# EAGLE schematic main_board (EAGLE 9.6.2)
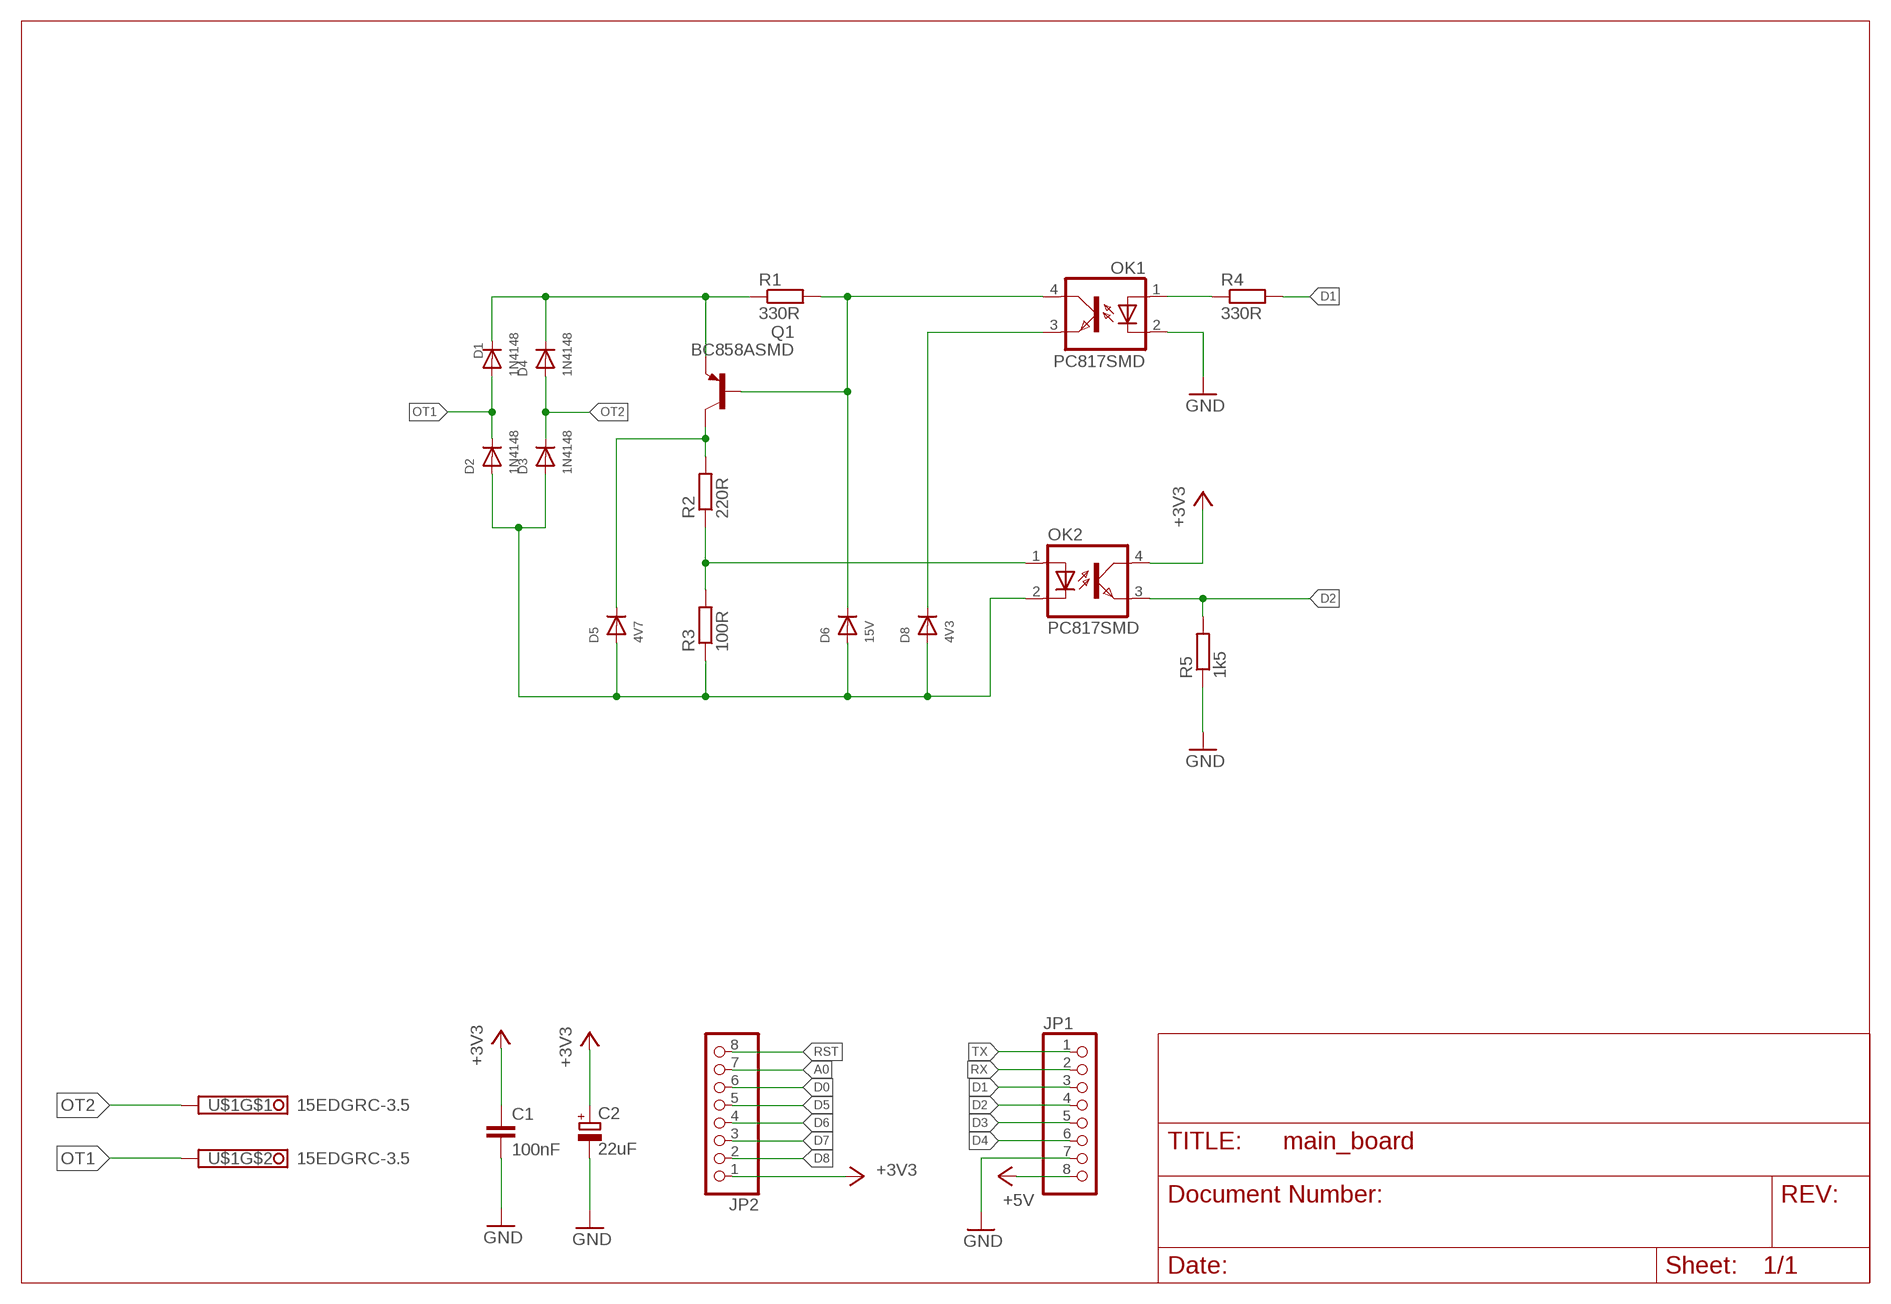
[diagram p0: schematic, sheet 1]

## Parts
C1  100nF  C-EUC0805  [C0805]
C2  22uF  CPOL-EUC/6032-28R  [C/6032-28R]
D1  1N4148  DIODESOD-123  [SOD-123]
D2  1N4148  DIODESOD-123  [SOD-123]
D3  1N4148  DIODESOD-123  [SOD-123]
D4  1N4148  DIODESOD-123  [SOD-123]
D5  4V7  DIODESMA  [SMADIODE]
D6  15V  DIODESMA  [SMADIODE]
D8  4V3  DIODESMA  [SMADIODE]
JP1  PINHD-1X8  [1X08]
JP2  PINHD-1X8  [1X08]
OK1  PC817SMD  [DIL4-SMD]
OK2  PC817SMD  [DIL4-SMD]
Q1  BC858ASMD  [SOT23-BEC]
R1  330R  R-EU_M0805  [M0805]
R2  220R  R-EU_M0805  [M0805]
R3  100R  R-EU_M0805  [M0805]
R4  330R  R-EU_M0805  [M0805]
R5  1k5  R-EU_M0805  [M0805]
U$1  15EDGRC-3.5  [15EDGRC-3.5/2P]

## Nets
+3V3: C1.1 C2.+ JP2.1 OK2.4(COL)
+5V: JP1.8
A0: JP2.7
D0: JP2.6
D1: JP1.3 R4.2
D2: JP1.4 OK2.3(EMIT) R5.2
D3: JP1.5
D4: JP1.6
D5: JP2.5
D6: JP2.4
D7: JP2.3
D8: JP2.2
GND: C1.2 C2.- JP1.7 OK1.2(C) R5.1
N$1: D2.A D3.A D5.A D6.A D8.A OK2.2(C) R3.1
N$2: D1.C D4.C Q1.E R1.1
N$3: D8.C OK1.3(EMIT)
N$4: OK2.1(A) R2.1 R3.2
N$5: D5.C Q1.C R2.2
N$6: D6.C OK1.4(COL) Q1.B R1.2
N$8: OK1.1(A) R4.1
OT1: D1.A D2.C U$1.P$4
OT2: D3.C D4.A U$1.P$3
RST: JP2.8
RX: JP1.2
TX: JP1.1

## Library data of the parts
C1 = rcl:C-EU: CAPACITOR, European symbol; SPICEPREFIX: C
C2 = rcl:CPOL-EU: POLARIZED CAPACITOR, European symbol; SPICEPREFIX: C
D1-D6 D8 = adafruit:DIODE: Diode SMADIODE - SMA Surface Mount Package 20V 1A Schottky Diode Digikey: 641-1014-6-ND DO-1N4148 - Through Hole Small Current Diode SOD-123 20V 1 A (.5mV Vf) Schottky Diode - Digikey: MBRX120TPMSCT-ND SOD-323 10V 570mA (.38mV Vf, 3ns) Schottky Diode - Digikey: ZLLS410CT-ND SOD-523 30V 30mA Schottky Diode (RB751S-40TE61) - Digikey: RB751S-40TE61CT-ND SOT23-R/W - SOT23 Package (R = Solder Paste/Reflow Ovens, W = Hand-Soldering) BAT54Film 40V 300mA - Digikey: 497-7162-1-ND
JP1 JP2 = pinhead:PINHD-1X8: PIN HEADER
OK1 OK2 = optocoupler-3-jcn:PC817: SHARP OPTO COUPLER
Q1 = transistor-pnp:BC858*: PNP Transistror
R1-R5 = rcl:R-EU_: RESISTOR, European symbol; SPICEPREFIX: R
U$1 = con-phoenix-350v2:15EDGRC-3.5